# EAGLE design jtag-adapter-3-5 (EAGLE 8.4.3)
AUTHOR: Balazs Racz; DRAWING_TITLE: SWD adaptor board; REVISION: A; YEAR: 2018
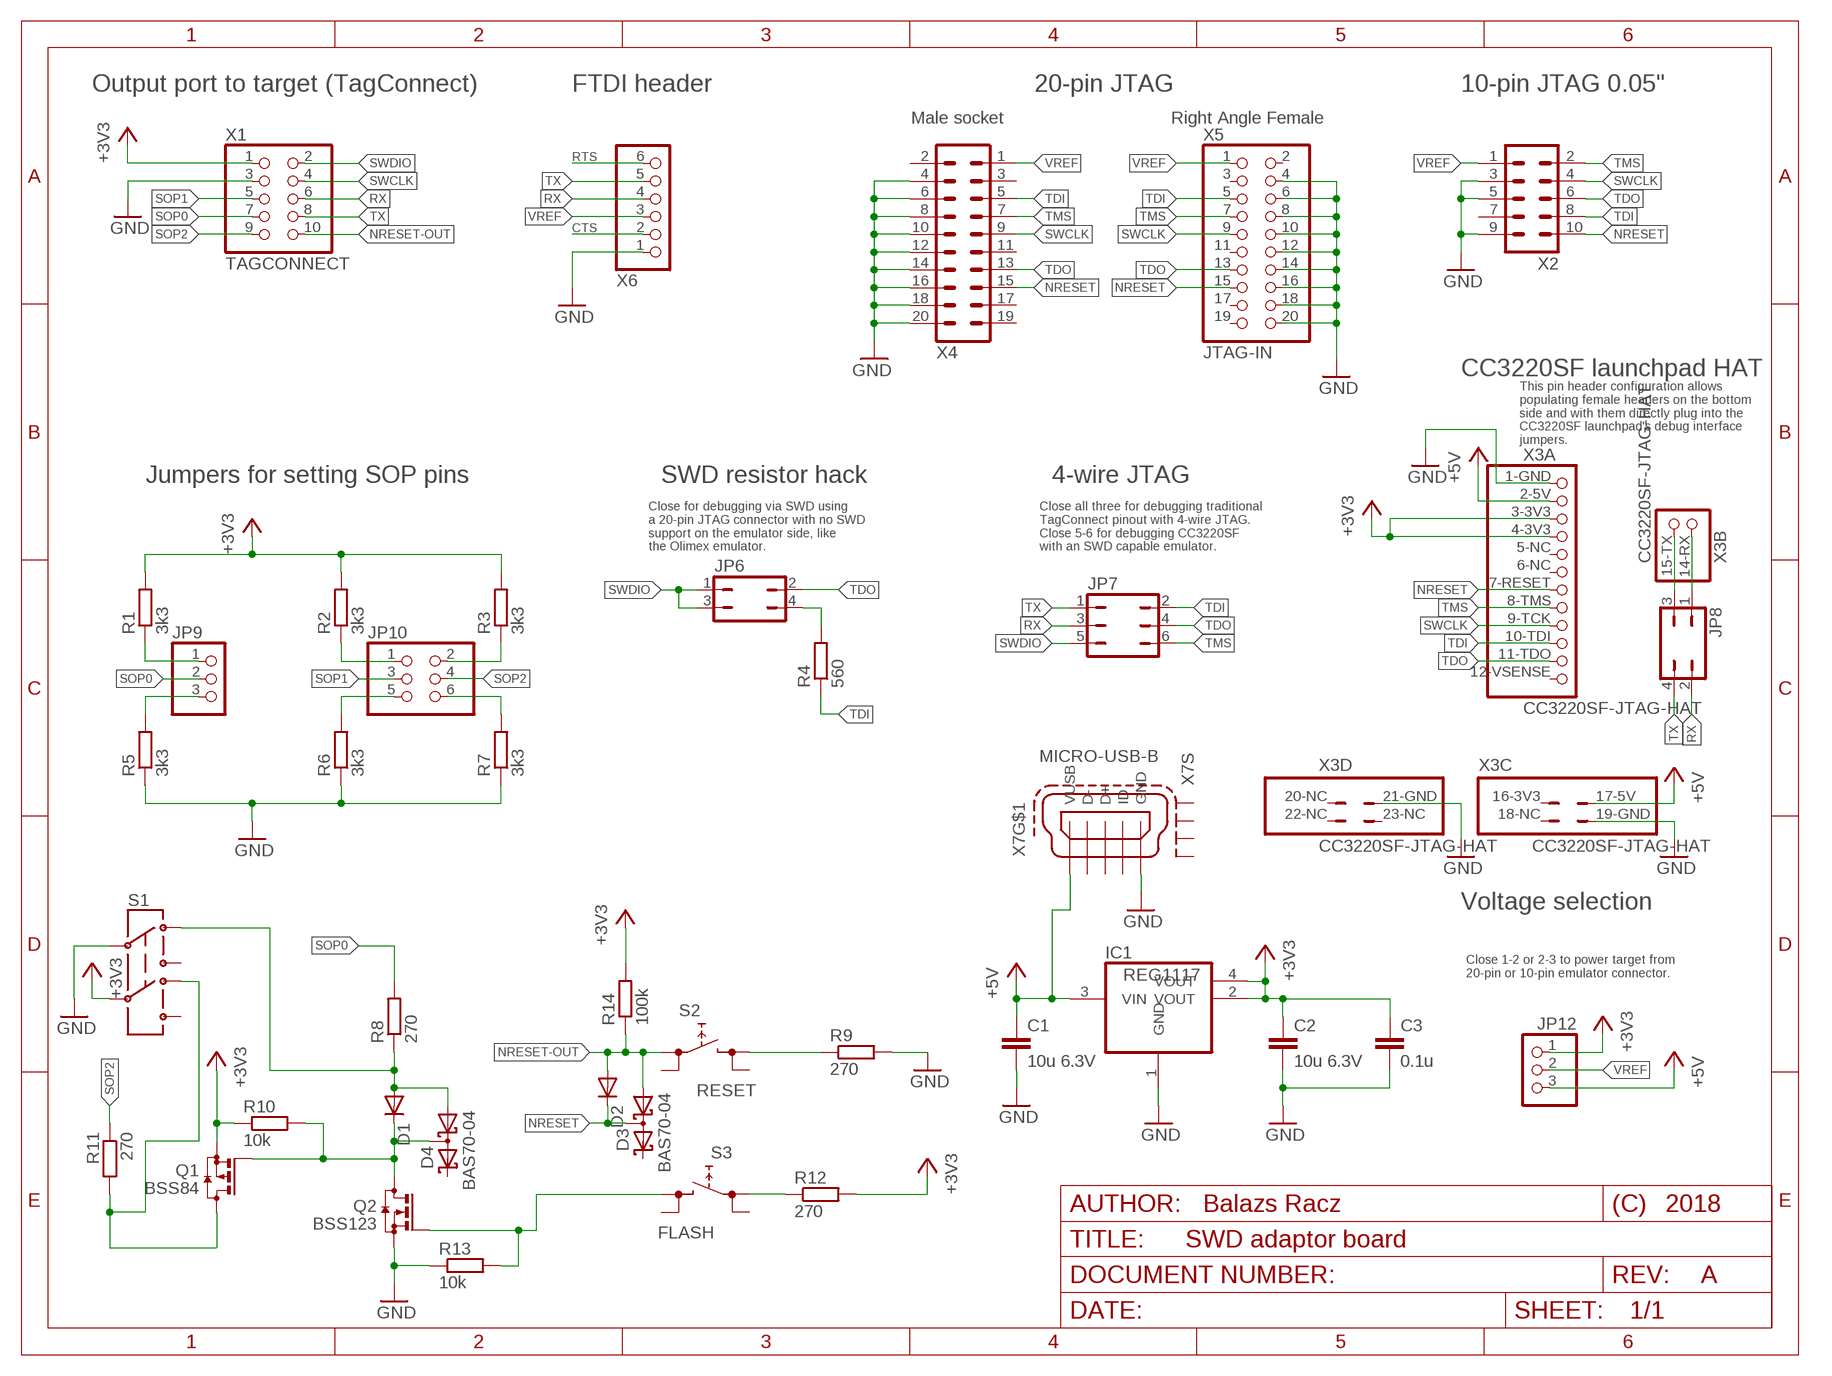
[diagram p0: schematic, sheet 1]

## Parts
C1  10u 6.3V  C-EUC0603K  [C0603K]
C2  10u 6.3V  C-EUC0603K  [C0603K]
C3  0.1u  C-EUC0603K  [C0603K]
D1  DIODE-MINIMELF  [MINIMELF]
D2  DIODE-MINIMELF  [MINIMELF]
D3  BAS70-04  [SOT23]
D4  BAS70-04  [SOT23]
IC1  REG1117  [SOT223]
JP6  JP2Q  [JP2Q]
JP7  JP3Q  [JP3Q]
JP8  JP2Q  [JP2Q]
JP9  PINHD-1X3  [1X03]
JP10  PINHD-2X3  [2X03]
JP12  PINHD-1X3  [1X03]
Q1  BSS84  [SOT23]
Q2  BSS123  [SOT23]
R1  3k3  R-EU_R0805  [R0805]
R2  3k3  R-EU_R0805  [R0805]
R3  3k3  R-EU_R0805  [R0805]
R4  560  R-EU_R0805  [R0805]
R5  3k3  R-EU_R0805  [R0805]
R6  3k3  R-EU_R0805  [R0805]
R7  3k3  R-EU_R0805  [R0805]
R8  270  R-EU_R0805  [R0805]
R9  270  R-EU_R0805  [R0805]
R10  10k  R-EU_R0805  [R0805]
R11  270  R-EU_R0805  [R0805]
R12  270  R-EU_R0805  [R0805]
R13  10k  R-EU_R0805  [R0805]
R14  100k  R-EU_R0805  [R0805]
S1  SWITCH-DPDTJS202011CQN  [DPDT-2.5X3.2MM]
S2  RESET  TACTSW-6X6S  [TACTSW-6X6]
S3  FLASH  TACTSW-6X6S  [TACTSW-6X6]
X1  TAGCONNECT  PINHD-2X5CN  [CON10M]
X2  MA05-2_0.05X0.05  [MA05-2_0.05_X_0.05]
X3  CC3220SF-JTAG-HAT  [JTAG-LAUNCHPAD-3220SF]
X4  MA10-2S  [MA10-2-SHROUDED]
X5  JTAG-IN  PINHD-2X10  [2X10]
X6  PINHD-1X6  [1X06]
X7  MICRO-USB-B  [MICRO-B-PAC]

## Nets
+3V3: C2.1 C3.1 IC1.2(VOUT) IC1.4(VOUT) JP12.1 Q1.2(S) R1.2 R2.2 R3.2 R10.1 R12.2 R14.2 S1.5(2C) X1.1 X3.3-3V3 X3.4-3V3
+5V: C1.1 IC1.3(VIN) JP12.3 X3.2-5V X3.17-5V X7.1(VUSB)
CTS: X6.2
FL-SOP2-PU: Q1.3(D) R11.2 S1.4(2A)
GND: C1.2 C2.2 C3.2 IC1.1(GND) Q2.2(S) R5.1 R6.1 R7.1 R9.2 R13.1 S1.2(1C) X1.3 X2.3 X2.5 X2.9 X3.1-GND X3.19-GND X3.21-GND X4.4 X4.6 X4.8 X4.10 X4.12 X4.14 X4.16 X4.18 X4.20 X5.4 X5.6 X5.8 X5.10 X5.12 X5.14 X5.16 X5.18 X5.20 X6.1 X7.5(GND)
N$1: R9.1 S2.3(2.1)
N$4: JP6.4 R4.2
N$9: D1.C D4.3(C1A2) Q1.1(G) Q2.3(D) R10.2
N$10: R12.1 S3.1(1.1)
N$11: Q2.1(G) R13.2 S3.3(2.1)
N$14: JP8.1 X3.14-RX
N$15: JP8.3 X3.15-TX
N$16: D1.A D4.1(A1) R8.1 S1.1(1A)
NRESET: D2.C D3.3(C1A2) X2.10 X3.7-RESET X4.15 X5.15
NRESET-OUT: D2.A D3.1(A1) R14.1 S2.1(1.1) X1.10
RTS: X6.6
RX: JP7.3 JP8.2 X1.6 X6.4
SOP0: JP9.2 R8.2 X1.7
SOP0H: JP9.1 R1.1
SOP0L: JP9.3 R5.2
SOP1: JP10.3 X1.5
SOP1H: JP10.1 R2.1
SOP1L: JP10.5 R6.2
SOP2: JP10.4 R11.1 X1.9
SOP2H: JP10.2 R3.1
SOP2L: JP10.6 R7.2
SWCLK: X1.4 X2.4 X3.9-TCK X4.9 X5.9
SWDIO: JP6.1 JP6.3 JP7.5 X1.2
TDI: JP7.2 R4.1 X2.8 X3.10-TDI X4.5 X5.5
TDO: JP6.2 JP7.4 X2.6 X3.11-TDO X4.13 X5.13
TMS: JP7.6 X2.2 X3.8-TMS X4.7 X5.7
TX: JP7.1 JP8.4 X1.8 X6.5
VREF: JP12.2 X2.1 X4.1 X5.1 X6.3
Unconnected: D3.2(C2) D4.2(C2) S1.3(1B) S1.6(2B) S2.2(1.2) S2.4(2.2) S3.2(1.2) S3.4(2.2) X2.7 X3.5-NC X3.6-NC X3.12-VSENSE X3.16-3V3 X3.18-NC X3.20-NC X3.22-NC X3.23-NC X4.2 X4.3 X4.11 X4.17 X4.19 X5.2 X5.3 X5.11 X5.17 X5.19 X7.2(D-) X7.3(D+) X7.4(ID) X7.M1(S:S1) X7.M2(S:S2) X7.M3(S:S3) X7.M4(S:S4)

## Notes on the sheet
- Output port to target (TagConnect) | FTDI header | 20-pin JTAG | 10-pin JTAG 0.05"
- Male socket | Right Angle Female
- CC3220SF launchpad HAT
- This pin header configuration allows
  populating female headers on the bottom
  side and with them directly plug into the 
  CC3220SF launchpad's debug interface
  jumpers.
- Jumpers for setting SOP pins | SWD resistor hack | 4-wire JTAG
- Close for debugging via SWD using
  a 20-pin JTAG connector with no SWD
  support on the emulator side, like
  the Olimex emulator.
- Close all three for debugging traditional
  TagConnect pinout with 4-wire JTAG.
  Close 5-6 for debugging CC3220SF
  with an SWD capable emulator.
- Voltage selection
- Close 1-2 or 2-3 to power target from
  20-pin or 10-pin emulator connector.

## Library data of the parts
C1-C3 = resistor:C-EU: CAPACITOR, European symbol
D1 D2 = diode:DIODE-: DIODE
D3 D4 = diode:BAS70-04: Silicon Schottky Diodes General-purpose diode for high-speed switching
IC1 = trainlib:REG1117: 800mA and 1A Low Dropout (LDO) Positive Regulator 1.8V, 2.5V, 2.85V, 3.3V, 5V, and Adj; MPN: REG1117; OC_FARNELL: 1097566; OC_NEWARK: 14P6981
JP6 JP8 = trainlib:JP2Q: JUMPER
JP7 = trainlib:JP3Q: JUMPER
JP9 JP12 = adafruit:PINHD-1X3: PIN HEADER
JP10 = pinhead:PINHD-2X3: PIN HEADER
Q1 = trainlib:BSS84: P-CHANNEL MOS FET
Q2 = transistor-small-signal:BSS123: N-CHANNEL MOS FET
R1-R14 = rcl:R-EU_: RESISTOR, European symbol
S1 = trainlib:SWITCH-DPDT: DPDT Version of the COM-00597
S2 S3 = trainlib:TACTSW-6X6: 6.2 X 6.5mm TACT Switch (SMD) Source: http://www3.alps.co.jp/WebObjects/catalog.woa/PDF/E/Switch/Tact/SKHM/SKHM.PDF
X1 = trainlib:PINHD-2X5: PIN HEADER
X2 = trainlib:MA05-2: PIN HEADER
X3 = trainlib:CC3220SF-JTAG-HAT
X4 = tcs:MA10-2: PIN HEADER
X5 = pinhead:PINHD-2X10: PIN HEADER
X6 = pinhead:PINHD-1X6: PIN HEADER
X7 = trainlib:MICRO-USB-B: MINI USB-B Conector Source: www.cypressindustries.com

## Net classes
1 pwr: width 0.254 mm

## Board
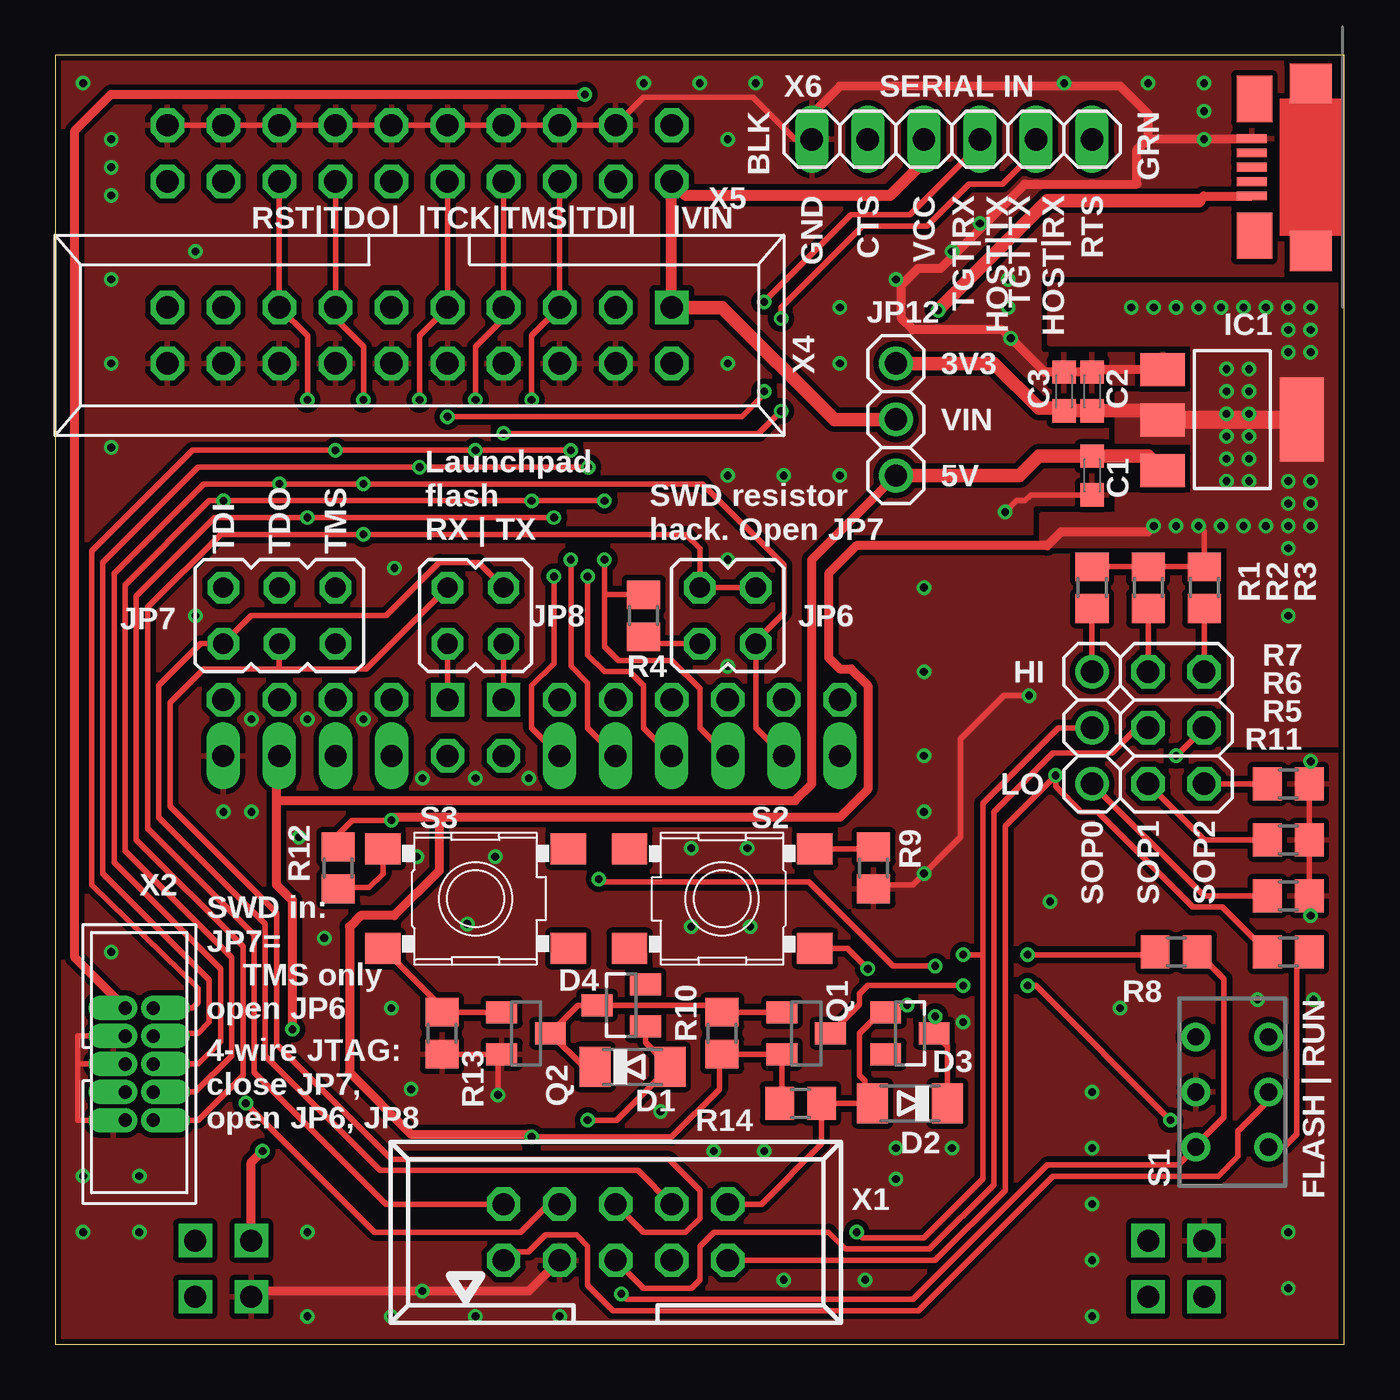
[diagram p1: board, top side]
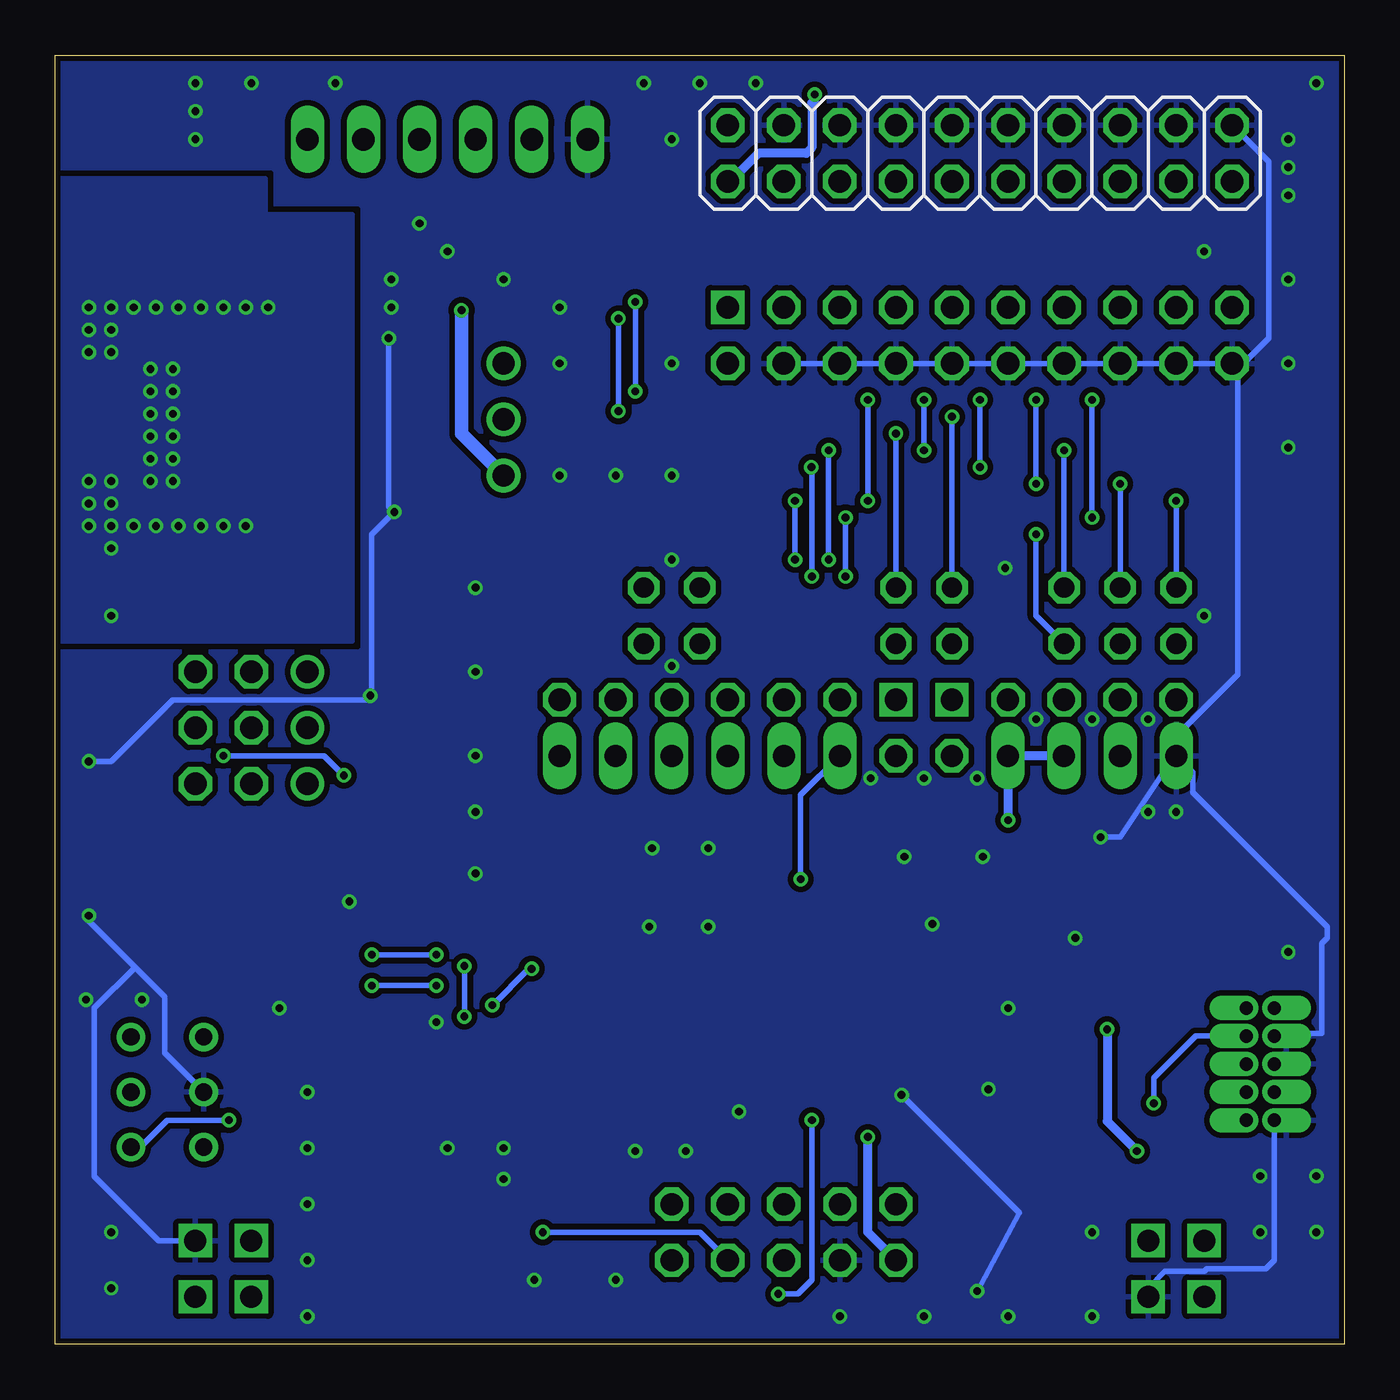
[diagram p2: board, bottom side, seen from below]

Size 58.42 x 58.42 mm. Coordinates in mm from the lower left corner, seen from the top.
Outline: 0,0 58.42,0 58.42,58.42 0,58.42 0,0
Copper layers (1*16): Top 0.035mm / dielectric 1.5mm / Bottom 0.035mm
Design rules "SeeedStudio_2layer_DRU_no_angle_20140221 *": minimum track width 6mil, minimum drill 12mil, track to track 10mil, track to pad 8mil, pad to pad 6mil, via to via 10mil, smd to smd 0mil, copper to edge 10mil, drill to drill 10mil, minimum pad ring 10mil, minimum via ring 6mil, stop-mask expansion 2mil, vias tented up to drill 100mil, thermal gap 10mil

### Footprints (pad centres in the part's own frame; a part is rotated, then mirrored left to right if it is on the bottom)
C0603K = smd 1.05 x 1.08: 1 -0.875,0; 2 0.875,0
MINIMELF = smd 1.4 x 1.8: A 1.7,0; C -1.7,0
SOT23 = smd 1 x 1.4: 1 -0.95,-1.1; 2 0.95,-1.1; 3 0,1.1
SOT223 = smd 1.499 x 2.007: 1 -2.261,-3.15; 2 0.025,-3.15; 3 2.311,-3.15 | smd 3.81 x 2.007: 4 0,3.15
JP2Q = drill 0.914 octagon: 1 -1.27,-1.27; 2 -1.27,1.27; 3 1.27,-1.27; 4 1.27,1.27
JP3Q = drill 0.914 octagon: 1 -2.54,-1.27; 2 -2.54,1.27; 3 0,-1.27; 4 0,1.27; 5 2.54,-1.27; 6 2.54,1.27
1X03 = drill 1.016: 1 -2.54,0; 2 0,0; 3 2.54,0
2X03 = drill 1.016 octagon: 1 -2.54,-1.27; 2 -2.54,1.27; 3 0,-1.27; 4 0,1.27; 5 2.54,-1.27; 6 2.54,1.27
R0805 = smd 1.3 x 1.5: 1 -0.95,0; 2 0.95,0
DPDT-2.5X3.2MM = drill 0.787 pad 1.27: 1 -2.5,1.65; 2 0,1.65; 3 2.5,1.65; 4 -2.5,-1.65; 5 0,-1.65; 6 2.5,-1.65
TACTSW-6X6 = smd 1.6 x 1.4: 1 -4.2,2.25; 2 4.2,2.25; 3 -4.2,-2.25; 4 4.2,-2.25
CON10M = drill 1 octagon: 1 -5.08,-1.27; 2 -5.08,1.27; 3 -2.54,-1.27; 4 -2.54,1.27; 5 0,-1.27; 6 0,1.27; 7 2.54,-1.27; 8 2.54,1.27; 9 5.08,-1.27; 10 5.08,1.27
MA05-2_0.05_X_0.05 = drill 0.6 pad 0.813 offset: 1 -2.54,-0.635; 2 -2.54,0.635; 3 -1.27,-0.635; 4 -1.27,0.635; 5 0,-0.635; 6 0,0.635; 7 1.27,-0.635; 8 1.27,0.635; 9 2.54,-0.635; 10 2.54,0.635
JTAG-LAUNCHPAD-3220SF = drill 1 long: 1-GND 0,0; 2-5V 2.54,0; 3-3V3 5.08,0; 4-3V3 7.62,0; 7-RESET 15.24,0; 8-TMS 17.78,0; 9-TCK 20.32,0; 10-TDI 22.86,0; 11-TDO 25.4,0; 12-VSENSE 27.94,0 | drill 1 octagon: 5-NC 10.16,0; 6-NC 12.7,0; NC1 7.62,2.54; NC2 5.08,2.54; NC3 2.54,2.54; NC4 0,2.54; NC5 15.24,2.54; NC6 17.78,2.54; NC7 20.32,2.54; NC8 22.86,2.54; NC9 25.4,2.54; NC10 27.94,2.54 | drill 1 square: 14-RX 10.16,2.54; 15-TX 12.7,2.54; 16-3V3 -1.27,-21.971; 17-5V 1.27,-21.971; 18-NC -1.27,-24.511; 19-GND 1.27,-24.511; 20-NC 41.91,-21.971; 21-GND 44.45,-21.971; 22-NC 41.91,-24.511; 23-NC 44.45,-24.511
MA10-2-SHROUDED = drill 1.016 square: 1 -11.43,-1.27 | drill 1.016 octagon: 2 -11.43,1.27; 3 -8.89,-1.27; 4 -8.89,1.27; 5 -6.35,-1.27; 6 -6.35,1.27; 7 -3.81,-1.27; 8 -3.81,1.27; 9 -1.27,-1.27; 10 -1.27,1.27; 11 1.27,-1.27; 12 1.27,1.27; 13 3.81,-1.27; 14 3.81,1.27; 15 6.35,-1.27; 16 6.35,1.27; 17 8.89,-1.27; 18 8.89,1.27; 19 11.43,-1.27; 20 11.43,1.27
2X10 = drill 1.016 octagon: 1 -11.43,-1.27; 2 -11.43,1.27; 3 -8.89,-1.27; 4 -8.89,1.27; 5 -6.35,-1.27; 6 -6.35,1.27; 7 -3.81,-1.27; 8 -3.81,1.27; 9 -1.27,-1.27; 10 -1.27,1.27; 11 1.27,-1.27; 12 1.27,1.27; 13 3.81,-1.27; 14 3.81,1.27; 15 6.35,-1.27; 16 6.35,1.27; 17 8.89,-1.27; 18 8.89,1.27; 19 11.43,-1.27; 20 11.43,1.27
1X06 = drill 1.016 long: 1 -6.35,0; 2 -3.81,0; 3 -1.27,0; 4 1.27,0; 5 3.81,0; 6 6.35,0
MICRO-B-PAC = smd 1.35 x 0.4: 1 2.675,1.3; 2 2.675,0.65; 3 2.675,0; 4 2.675,-0.65; 5 2.675,-1.3 | smd 1.9 x 1.8: M1 0,-3.8; M2 0,3.8 | smd 1.6 x 2.1: M3 2.55,3.1; M4 2.55,-3.1

### Placement (x,y rotation side)
C1  46.99,39.37 270 top
C2  46.99,43.18 90 top
C3  45.72,43.18 90 top
D1  26.16,12.57 0 top
D2  38.73,10.92 180 top
D3  38.73,14.1 270 top
D4  25.65,15.37 90 top
IC1  53.34,41.91 270 top
JP6  30.48,33.02 180 top
JP7  10.16,33.02 0 top
JP8  19.05,33.02 0 top
JP9  46.99,27.94 270 top
JP10  50.8,27.94 270 top
JP12  38.1,41.91 270 top
Q1  34.04,14.1 270 top
Q2  21.34,14.1 270 top
R1  46.99,34.29 90 top
R2  49.53,34.29 90 top
R3  52.07,34.29 90 top
R4  26.67,33.02 270 top
R5  55.88,20.32 180 top
R6  55.88,22.86 180 top
R7  55.88,25.4 180 top
R8  50.8,17.78 180 top
R9  37.08,21.59 270 top
R10  30.23,14.1 90 top
R11  55.88,17.78 0 top
R12  12.83,21.59 90 top
R13  17.53,14.1 90 top
R14  33.78,10.92 180 top
S1  53.34,11.43 90 top
S2  30.23,20.19 180 top
S3  19.05,20.19 0 top
X1  25.4,5.08 0 top
X2  3.81,12.7 270 top
X3  7.62,26.67 0 top
X4  16.51,45.72 180 top
X5  16.51,53.98 0 bottom
X6  40.64,54.61 0 top
X7  56.9,53.34 180 top

### Tracks (layer width: path | path; a pad name or v marks a point on that pad's centre or on a via)
+3V3  (via drill 0.35)
  Top 0.254: R1.2 R2.2 R3.2 52.07,36.83 v51.82,37.08 | S1.5 54.99,11.05 53.59,9.65 53.59,8.51 52.7,7.62 45.21,7.62 39.12,1.52 25.27,1.52 24.13,2.67 24.13,4.45 23.62,4.95 22.23,4.95 21.46,4.19 20.7,4.19 X1.1 | R12.2 12.83,23.11 13.46,23.75 v15.24,23.75 | v21.59,9.4 27.94,9.4 30.1,11.56 30.1,13.02 R10.1 Q1.2 32.94,11.03 R14.2
  Top 0.406: v49.78,37.08 49.53,36.83 45.59,36.83 44.96,36.2 36.32,36.2 35.05,34.92 35.05,31.11 35.56,30.61 36.07,30.61 36.83,29.84 36.83,25.15 35.56,23.88 17.4,23.88 | 17.4,23.88 15.37,23.88 v15.24,23.75 | 17.4,23.88 17.4,21.46 15.37,19.43 13.84,19.43 13.34,18.92 13.34,12.32 16.13,9.53 21.46,9.53 v21.59,9.4
  Top 0.61: IC1.2 49.77,42.3 C2.1 C3.1 45.61,42.42 44.58,42.42 42.55,44.45 JP12.1
  Top 0.813: IC1.2 50.22,41.91 IC1.4
  Bottom 0.406: X1.1 21.59,5.08 v21.59,9.4 | X3.3-3V3 X3.4-3V3 v15.24,23.75
  other vias: 48.77,46.99 49.78,46.99 50.8,46.99 51.82,46.99 52.83,46.99 53.85,46.99 54.86,46.99 55.88,46.99 55.88,45.97 55.88,44.96 56.9,44.96 56.9,45.97 56.9,46.99 55.88,39.12 56.9,39.12 56.9,38.1 55.88,38.1 55.88,37.08 56.9,37.08 54.1,44.2 54.1,43.18 54.1,42.16 54.1,41.15 54.1,40.13 54.1,39.12 53.09,44.2 53.09,43.18 53.09,42.16 53.09,41.15 53.09,40.13 53.09,39.12 54.86,37.08 53.85,37.08 52.83,37.08 50.8,37.08 55.88,36.07 55.88,33.02
  pour Top (rank 3, no thermals): 51.56,43.05 48.13,43.05 48.13,40.89 51.56,40.89 51.56,38.48 48.13,38.48 48.13,37.59 44.7,37.59 44.7,36.2 53.21,36.2 53.21,27.18 58.29,27.18 58.29,48.01 45.09,48.01 45.09,45.34 51.56,45.34
  pour Bottom (rank 3, no thermals): 45.21,31.88 58.29,31.88 58.42,31.75 58.42,52.83 48.9,52.83 48.9,51.18 44.96,51.18 44.96,31.88
+5V  (via drill 0.35)
  Top 0.406: 51.82,51.82 52.04,52.04 X7.1 | X3.17-5V 8.89,8.26 v9.4,8.76 | 10.03,24.64 10.03,20.83 10.74,20.12 v10.74,14.28 | 10.03,24.64 10.03,26.54 | 10.03,26.54 X3.2-5V 10.03,26.67 10.03,26.54 | 10.03,24.64 33.53,24.64 34.29,25.4 34.29,35.56 JP12.3
  Top 0.61: IC1.3 49.54,40.24 C1.1 46.98,40.26 44.58,40.26 43.69,39.37 JP12.3 | v40.01,46.86 44.96,51.82 51.82,51.82
  Bottom 0.406: v10.74,14.28 10.74,10.11 v9.4,8.76
  Bottom 0.61: JP12.3 40.01,41.27 v40.01,46.86
FL-SOP2-PU  (via drill 0.35)
  Top 0.254: Q1.3 36.45,15.41 36.45,15.88 36.83,16.26 v41.15,16.26 | v44.07,16.26 44.45,16.26 v50.55,10.16 | R11.2 56.26,17.21 56.26,9.53 55.67,8.93 S1.4
  Bottom 0.254: v41.15,16.26 v44.07,16.26 | v50.55,10.16 53.34,10.16 54.57,8.93 S1.4
GND  (via drill 0.35)
  Top 0.254: X5.20 X5.18 X5.16 X5.14 X5.12 X5.10 X5.8 X5.6 X5.4 26.67,56.52 31.62,56.52 33.53,54.61 X6.1 | X2.3 1.02,13.97 1.02,12.7 | 1.02,12.7 1.02,10.16 X2.9 | X2.5 1.02,12.7 | v56.9,19.43 56.83,19.5 R5.1 R6.1 R7.1 56.9,25.47 v56.9,26.42 | v43.05,37.72 43.56,38.23 43.94,38.23 44.21,38.49 C1.2 | v20.07,11.3 20.07,12.98 Q2.2 R13.1 | R9.2 37.27,20.83 38.86,20.83 41.02,22.99 41.02,27.43 42.99,29.4 v44.13,29.4
  Top 0.406: X1.3 21.46,2.41 v16.64,2.41 9.14,2.41 X3.19-GND | 49.53,54.64 X7.5 | 49.53,54.64 49.53,55.75 48.26,57.02 35.56,57.02 34.29,55.75 X6.1 | IC1.1 47.11,44.17 C2.2 C3.2 44.84,44.05 v43.31,45.59 42.93,45.97 38.86,45.97 38.35,46.48 38.35,48.01 39.12,48.77 40.13,48.77 43.94,52.58 49.02,52.58 49.02,54.13 49.53,54.64
  Bottom 0.254: X4.4 X4.6 X4.8 X4.10 X4.12 X4.14 X4.16 X4.18 X4.20 | X4.20 4.57,44.45 3.43,45.59 3.43,53.59 X5.20 | X2.3 3.05,14.1 1.02,14.1 1.02,18.16 0.76,18.41 0.76,18.92 6.86,25.02 6.86,25.91 X3.1-GND 7.62,26.8 | 7.62,26.8 7.62,27.56 4.83,30.35 4.83,44.2 X4.20 | 51.56,11.3 S1.2 53.47,13.21 53.47,15.75 54.8,17.08 | 54.8,17.08 56.9,19.18 v56.9,19.43 | v56.9,26.42 55.88,26.42 53.09,29.21 44.32,29.21 v44.13,29.4 44.07,29.46 44.07,36.7 v43.05,37.72 43.31,37.97 v43.31,45.59 | X2.9 3.17,3.81 3.56,3.43 6.22,3.43 6.35,3.3 8.13,3.3 8.89,2.54 X3.19-GND | v11.05,22.99 10.16,22.99 7.62,26.8 | v20.07,11.3 14.73,5.97 v16.64,2.41 | X3.21-GND 53.72,4.7 56.64,7.62 56.64,15.24 54.8,17.08
  other vias: 39.37,30.48 39.37,34.29 39.37,26.67 45.09,20.07 48.26,15.24 46.99,11.43 46.99,8.89 40.64,8.89 38.1,8.89 46.99,6.35 46.99,3.81 46.99,1.27 55.88,5.08 55.88,2.54 35.56,39.37 33.02,39.37 30.48,39.37 30.48,35.56 30.48,44.45 35.56,44.45 35.56,46.99 38.1,48.26 43.18,46.99 43.18,48.26 41.91,50.8 40.64,49.53 45.72,57.15 49.53,57.15 52.07,57.15 52.07,55.88 52.07,54.61 31.75,57.15 29.21,57.15 26.67,57.15 30.48,54.61 1.27,57.15 2.54,54.61 2.54,53.34 2.54,52.07 2.54,48.26 2.54,44.45 6.35,49.53 2.54,40.64 8.89,28.32 11.43,28.32 13.97,28.32 30.48,30.73 31.37,22.48 2.54,17.78 1.27,7.62 3.81,7.62 3.81,5.08 1.27,5.08 11.43,5.08 11.43,1.27 15.24,1.27 19.05,1.27 22.86,1.27 7.62,24.13 8.89,24.13 28.83,22.48 28.83,18.92 31.5,18.92 18.67,19.05 19.94,22.1 15.24,15.24 16.13,11.56 12.19,18.41 32.13,8.76 29.84,8.76 16.38,22.1 27.43,10.54 36.7,2.92 33.02,2.92 38.1,7.49 39.37,21.34 39.37,24.13 54.48,15.62 57.02,15.62 41.15,14.61 19.05,25.65 21.46,25.65 16.64,25.65 15.37,35.18 6.35,33.02
  pour Top (rank 6): 0,58.42 58.42,58.42 58.42,0 0,0
  pour Bottom (rank 6): 58.42,58.42 0,58.42 0,0 58.42,0
N$1
  Top 0.254: S2.3 36.99,22.44 R9.1
N$4
  Top 0.254: R4.2 26.99,31.75 JP6.4
N$9
  Top 0.254: D1.C 23.96,12.57 Q2.3 23.71,15.37 D4.3 29.91,15.37 R10.2 Q1.1
N$10
  Top 0.254: S3.1 14.85,21.33 14.22,20.7 12.89,20.7 R12.1
N$11
  Top 0.254: Q2.1 R13.2 17.53,15.27 S3.3
N$14
  Top 0.254: X3.14-RX JP8.1
N$15
  Top 0.254: X3.15-TX JP8.3
N$16  (via drill 0.35)
  Top 0.254: R8.1 52.96,16.57 52.96,10.29 51.69,9.02 S1.1 50.89,8.13 44.96,8.13 38.86,2.03 25.91,2.03 v25.65,2.29 | D4.1 26.75,13.68 D1.A 25.45,10.16 v24.13,10.16
  Bottom 0.254: v25.65,2.29 24.77,2.29 24.13,2.92 v24.13,10.16
NRESET  (via drill 0.35)
  Top 0.254: X5.15 X4.15 11.43,45.72 v11.43,42.8 | X2.10 6.48,10.16 8.51,12.19 8.51,18.03 3.68,22.86 3.68,33.91 7.24,37.47 v11.43,37.47 v22.61,37.47 | 22.61,26.92 X3.7-RESET 21.59,27.94 21.59,29.84 22.61,30.86 v22.61,34.8 | D2.C 40.44,13.5 D3.3 39.88,14.14 v39.88,14.86 | v24.64,21.08 24.77,20.95 34.16,20.95 37.97,17.14 v39.88,17.14
  Bottom 0.254: v11.43,42.8 v11.43,37.47 | v22.61,37.47 v22.61,34.8 | X3.7-RESET 24.64,24.89 v24.64,21.08 | v39.88,17.14 v39.88,14.86
NRESET-OUT  (via drill 0.35)
  Top 0.254: X1.10 32,6.35 34.73,9.08 R14.1 D2.A 36.7,11.25 36.7,11.94 36.45,12.19 36.45,14.1 37.4,15.05 D3.1 37.95,15.37 v38.61,15.37 | v36.83,17.02 35.91,17.94 S2.1
  Bottom 0.254: v38.61,15.37 36.96,17.02 v36.83,17.02
RX  (via drill 0.35)
  Top 0.254: X1.6 26.67,5.08 28.57,5.08 29.21,5.71 29.21,6.99 27.81,8.38 15.24,8.38 10.03,13.59 10.03,19.56 5.21,24.38 5.21,29.08 6.73,30.61 10.16,30.61 | JP7.3 10.16,30.61 | X6.4 41.91,54.36 38.73,51.18 36.07,51.18 v32.13,47.24 | v32.13,43.18 32.13,43.05 31.11,42.04 v17.78,42.04 | 10.16,30.61 14.1,30.61 JP8.2
  Bottom 0.254: JP8.2 v17.78,42.04 | v32.13,47.24 v32.13,43.18
SOP0  (via drill 0.35)
  Top 0.254: v36.32,5.08 36.58,4.83 39.37,4.83 42.04,7.49 42.04,17.65 | 42.04,17.65 42.04,24.51 45.47,27.94 JP9.2 | R8.2 49.72,17.65 v44.07,17.65 | v41.15,17.65 42.04,17.65
  Bottom 0.254: X1.7 29.21,5.08 v36.32,5.08 | v44.07,17.65 v41.15,17.65
SOP0H
  Top 0.254: JP9.1 R1.1
SOP0L
  Top 0.254: JP9.3 52.07,20.32 R5.2
SOP1
  Top 0.254: X1.5 26.67,2.54 28.83,2.54 29.21,2.92 29.21,4.45 29.84,5.08 35.05,5.08 35.81,4.32 39.62,4.32 42.55,7.24 42.55,24.13 45.21,26.8 47.88,26.8 49.02,27.94 JP10.3
SOP1H
  Top 0.254: JP10.1 R2.1
SOP1L
  Top 0.254: JP10.5 52.07,22.86 R6.2
SOP2  (via drill 0.35)
  Top 0.254: v50.8,26.67 JP10.4 | X1.9 39.88,3.81 43.05,6.99 43.05,23.5 v45.34,25.78 45.34,25.27 46.48,24.13 47.24,24.13 51.56,19.81 52.9,19.81 R11.1
  Bottom 0.254: v45.34,25.78 46.23,26.67 v50.8,26.67
SOP2H
  Top 0.254: JP10.2 R3.1
SOP2L
  Top 0.254: JP10.6 R7.2
SWCLK  (via drill 0.35)
  Top 0.254: X5.9 X4.9 16.51,45.72 v16.51,42.8 | X2.4 4.57,14.1 6.48,14.1 6.99,14.61 6.99,16.51 2.16,21.34 2.16,35.43 6.48,39.75 v16.51,39.75 v24.15,39.75 | v8.64,10.92 14.48,5.08 21.08,5.08 22.35,6.35 X1.4 | X3.9-TCK 26.67,27.94 26.67,29.84 26.04,30.48 24.89,30.48 24.13,31.24 v24.13,34.8
  Bottom 0.254: v16.51,42.8 v16.51,39.75 | v24.13,34.8 24.13,39.65 v24.15,39.75 | v8.64,10.92 8.64,12.06 6.73,13.97 X2.4
SWDIO  (via drill 0.35)
  Top 0.254: JP6.1 JP6.3 29.21,36.07 28.57,36.7 v13.97,36.7 7.49,36.7 4.19,33.4 4.19,23.37 9.02,18.54 9.02,12.32 14.99,6.35 X1.2
  Bottom 0.254: JP7.5 13.97,33.02 v13.97,36.7
TDI  (via drill 0.35)
  Top 0.254: X5.5 X4.5 21.59,45.72 v21.59,42.8 | 24.89,33.91 v24.89,35.56 | 24.89,33.91 24.89,31.62 25.53,30.99 27.94,30.99 29.21,29.72 29.21,27.94 X3.10-TDI | 26.35,33.97 R4.1 24.95,33.97 24.89,33.91 | X2.8 6.35,11.43 8,13.08 8,17.53 3.17,22.35 3.17,34.42 6.99,38.23 v7.62,38.23 v21.59,38.23 v24.89,38.23
  Bottom 0.254: JP7.2 v7.62,38.23 | v21.59,42.8 v21.59,38.23 | v24.89,38.23 v24.89,35.56
TDO  (via drill 0.35)
  Top 0.254: X5.13 X4.13 12.7,46.48 13.97,45.21 v13.97,42.8 | 32.89,26.8 X3.11-TDO 31.75,27.94 JP6.2 31.75,31.88 33.02,33.15 33.02,35.31 29.34,38.99 v13.97,38.99 v10.16,38.99 6.73,38.99 2.67,34.92 2.67,21.84 7.49,17.02 7.49,13.72 6.48,12.7 X2.6
  Bottom 0.254: JP7.4 v10.16,38.99 | v13.97,42.8 v13.97,38.99
TMS  (via drill 0.35)
  Top 0.254: X5.7 X4.7 20.32,46.48 19.05,45.21 v19.05,42.8 | X2.2 6.22,15.24 6.48,15.49 6.48,16.13 1.65,20.83 1.65,35.94 6.22,40.51 v12.7,40.51 v19.05,40.51 v23.37,40.51 | X3.8-TMS 24.13,27.94 24.13,29.97 23.37,30.73 v23.37,35.56
  Bottom 0.254: JP7.6 v12.7,40.51 | v23.37,35.56 v23.37,40.51 | v19.05,40.51 v19.05,42.8
TX  (via drill 0.35)
  Top 0.254: JP8.4 19.18,35.43 17.4,35.43 14.99,33.02 8.89,33.02 JP7.1 6.6,31.75 4.7,29.84 4.7,23.88 9.53,19.05 9.53,13.08 14.73,7.87 26.42,7.87 X1.8 | X6.5 44.45,54.1 42.93,52.58 41.4,52.58 39.5,50.67 36.58,50.67 32.89,46.99 v32.89,46.48 | v32.89,42.29 31.88,41.27 v20.32,41.27
  Bottom 0.254: JP8.4 v20.32,41.27 | v32.89,46.48 v32.89,42.29
VREF  (via drill 0.35)
  Top 0.406: X2.1 0.89,17.53 0.89,54.99 2.54,56.64 v24,56.64
  Top 0.508: X4.1 X5.1 28.57,52.07 37.85,52.07 39.37,53.59 X6.3
  Top 0.61: JP12.2 35.31,41.91 30.23,46.99 X4.1
  Bottom 0.406: v24,56.64 24,56.39 24.13,56.26 24.13,54.23 24.38,53.98 26.54,53.98 27.81,52.7 X5.1

### Text on the board
tNames: SERIAL IN | BLK | GRN | GND | CTS | VCC | TGT|RX / HOST|TX | TGT|TX / HOST|RX | RTS | RST|TDO| |TCK|TMS|TDI| |VIN | 3V3 | VIN | 5V | TDI | TDO | TMS | Launchpad / flash / RX | TX | SWD resistor / hack. Open JP7 | HI | LO | SOP0 | SOP1 | SOP2 | SWD in: / JP7= / TMS only / open JP6 | 4-wire JTAG: / close JP7, / open JP6, JP8 | FLASH | RUN